# EAGLE design PIC PROTO-BOARD-SMD (EAGLE 9.2.2)

## Sheet 1 of 3
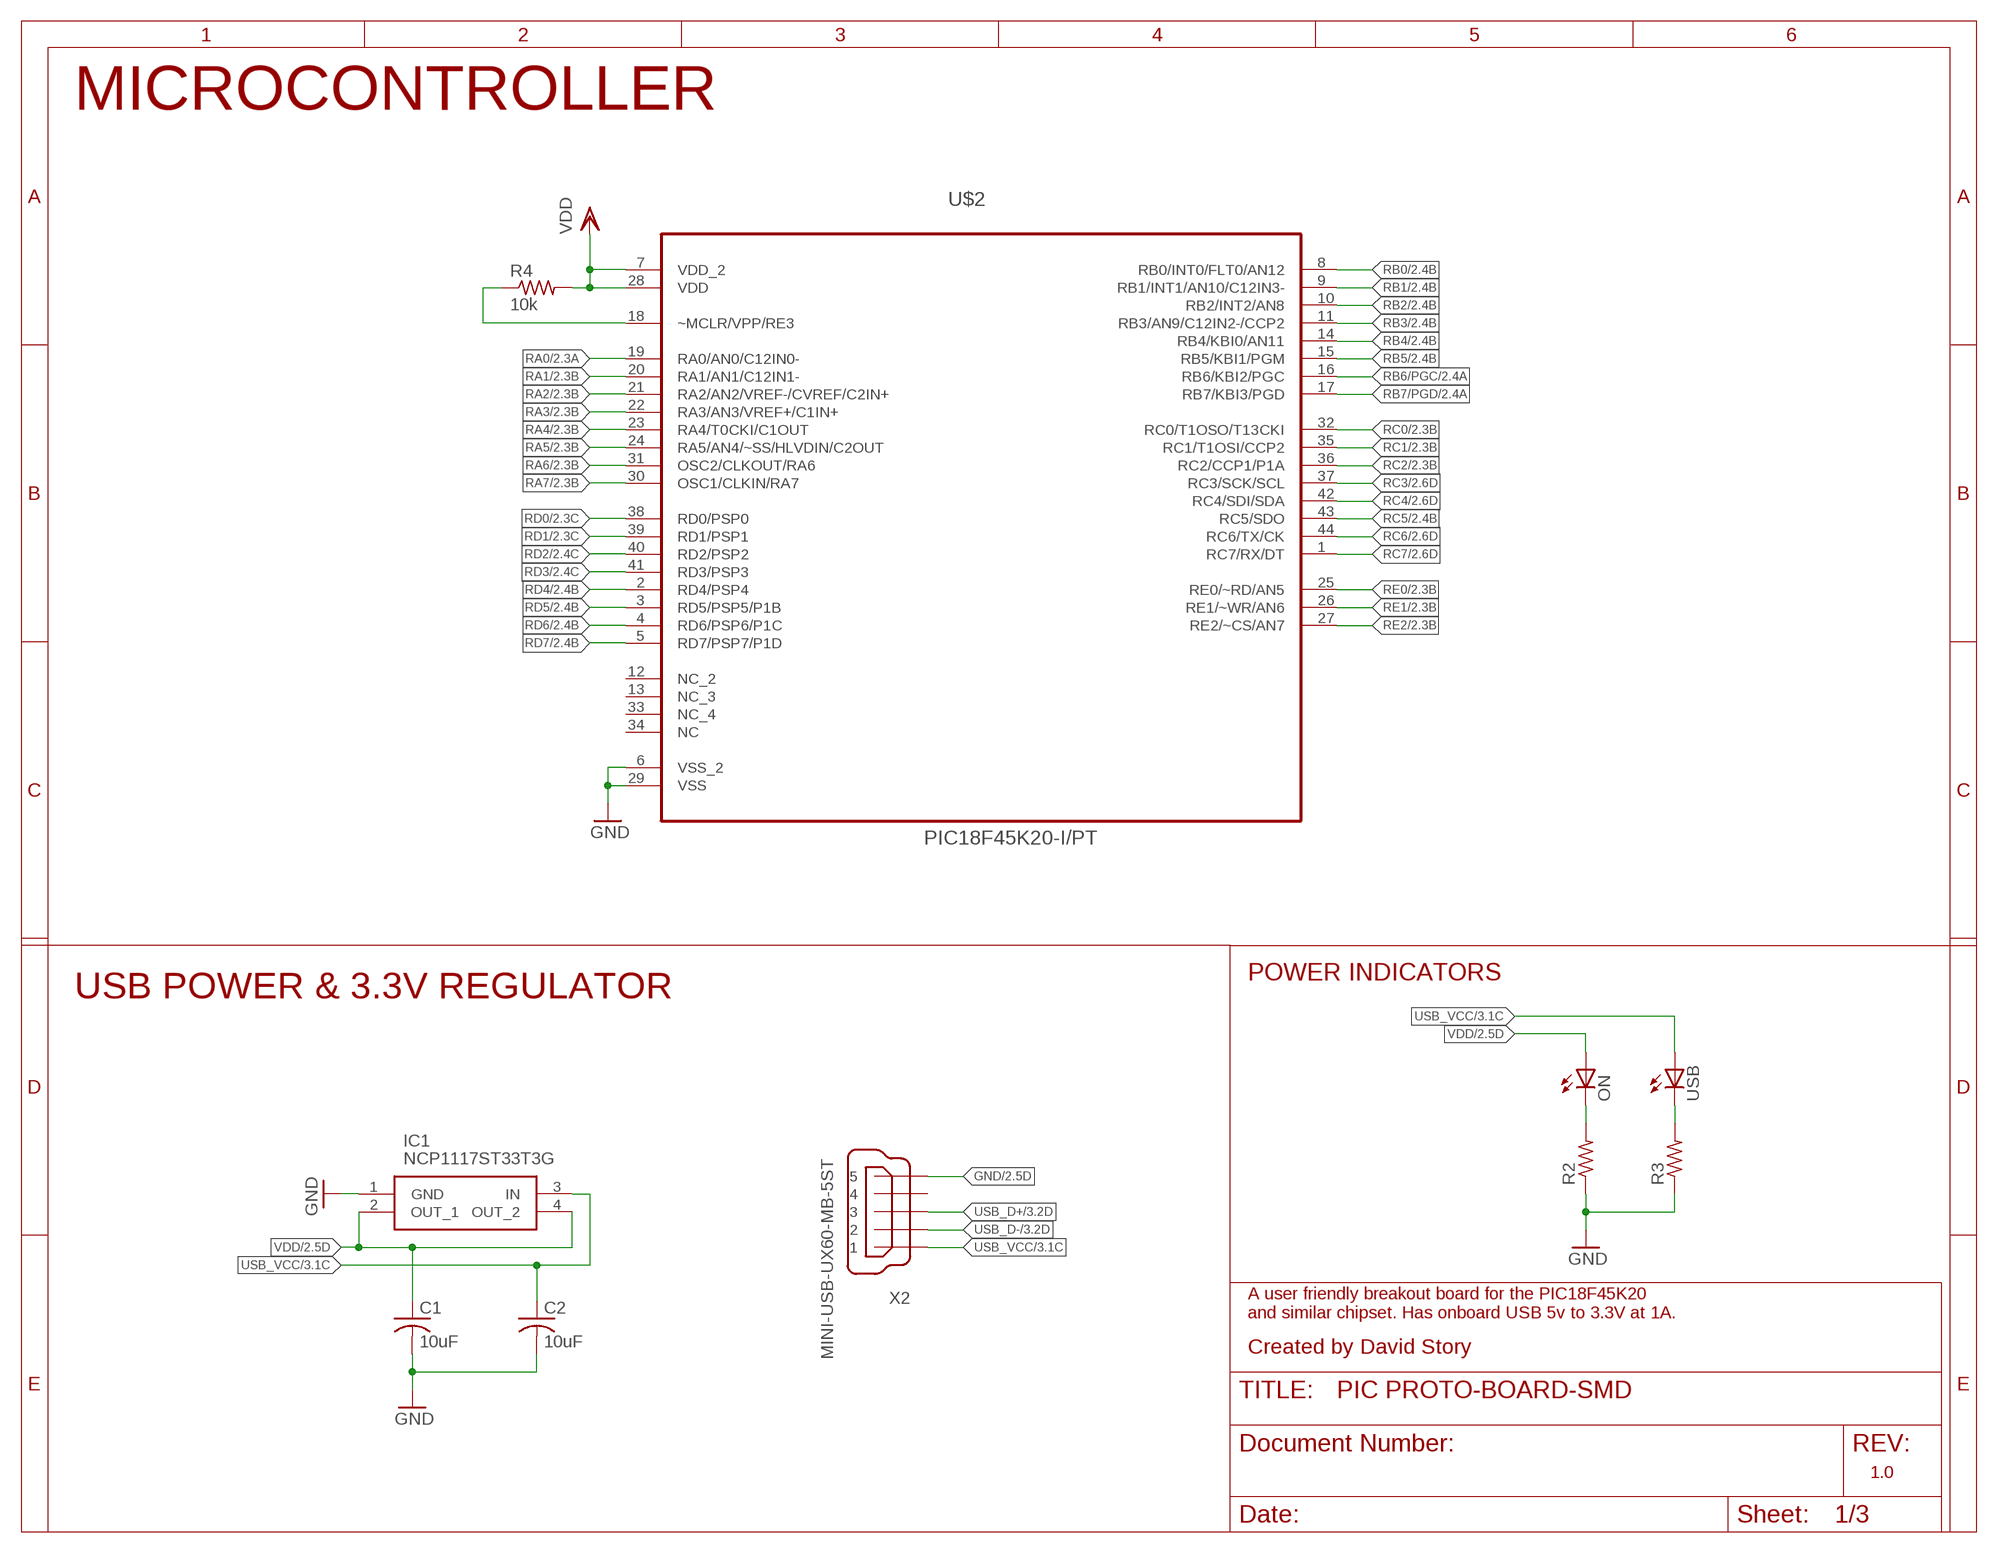
[diagram p0: schematic, sheet 1]

### Parts
C1  10uF  C-USC0805  [C0805]
C2  10uF  C-USC0805  [C0805]
IC1  NCP1117ST33T3G  [SOT230P700X180-4N]
ON  LEDCHIP-LED0603  [CHIP-LED0603]
R2  R-US_R0603  [R0603]
R3  R-US_R0603  [R0603]
R4  10k  R-US_R0805  [R0805]
U$2  PIC18F45K20-I/PT  [QFP80P1200X1200X120-44N]
USB  LEDCHIP-LED0603  [CHIP-LED0603]
X2  MINI-USB-UX60-MB-5ST  [UX60-MB-5ST]

### Nets
GND: C1.2 C2.2 IC1.1(GND) R2.1 R3.1 U$2.6(VSS_2) U$2.29(VSS) X2.5 ; also sheet 2,3
MCLR: R4.1 U$2.18(~MCLR/VPP/RE3) ; also sheet 2
ON_CATHODE: ON.C R2.2
RA0: U$2.19(RA0/AN0/C12IN0-) ; also sheet 2
RA1: U$2.20(RA1/AN1/C12IN1-) ; also sheet 2
RA2: U$2.21(RA2/AN2/VREF-/CVREF/C2IN+) ; also sheet 2
RA3: U$2.22(RA3/AN3/VREF+/C1IN+) ; also sheet 2
RA4: U$2.23(RA4/T0CKI/C1OUT) ; also sheet 2
RA5: U$2.24(RA5/AN4/~SS/HLVDIN/C2OUT) ; also sheet 2
RA6: U$2.31(OSC2/CLKOUT/RA6) ; also sheet 2
RA7: U$2.30(OSC1/CLKIN/RA7) ; also sheet 2
RB0: U$2.8(RB0/INT0/FLT0/AN12) ; also sheet 2
RB1: U$2.9(RB1/INT1/AN10/C12IN3-) ; also sheet 2
RB2: U$2.10(RB2/INT2/AN8) ; also sheet 2
RB3: U$2.11(RB3/AN9/C12IN2-/CCP2) ; also sheet 2
RB4: U$2.14(RB4/KBI0/AN11) ; also sheet 2
RB5: U$2.15(RB5/KBI1/PGM) ; also sheet 2
RB6/PGC: U$2.16(RB6/KBI2/PGC) ; also sheet 2
RB7/PGD: U$2.17(RB7/KBI3/PGD) ; also sheet 2
RC0: U$2.32(RC0/T1OSO/T13CKI) ; also sheet 2
RC1: U$2.35(RC1/T1OSI/CCP2) ; also sheet 2
RC2: U$2.36(RC2/CCP1/P1A) ; also sheet 2
RC3: U$2.37(RC3/SCK/SCL) ; also sheet 2,3
RC4: U$2.42(RC4/SDI/SDA) ; also sheet 2,3
RC5: U$2.43(RC5/SDO) ; also sheet 2
RC6: U$2.44(RC6/TX/CK) ; also sheet 2,3
RC7: U$2.1(RC7/RX/DT) ; also sheet 2,3
RD0: U$2.38(RD0/PSP0) ; also sheet 2
RD1: U$2.39(RD1/PSP1) ; also sheet 2
RD2: U$2.40(RD2/PSP2) ; also sheet 2
RD3: U$2.41(RD3/PSP3) ; also sheet 2
RD4: U$2.2(RD4/PSP4) ; also sheet 2
RD5: U$2.3(RD5/PSP5/P1B) ; also sheet 2
RD6: U$2.4(RD6/PSP6/P1C) ; also sheet 2
RD7: U$2.5(RD7/PSP7/P1D) ; also sheet 2
RE0: U$2.25(RE0/~RD/AN5) ; also sheet 2,3
RE1: U$2.26(RE1/~WR/AN6) ; also sheet 2,3
RE2: U$2.27(RE2/~CS/AN7) ; also sheet 2
USB_CATHODE: R3.2 USB.C
USB_D+: X2.3 ; also sheet 3
USB_D-: X2.2 ; also sheet 3
USB_VCC: C2.1 IC1.3(IN) USB.A X2.1 ; also sheet 3
VDD: C1.1 IC1.2(OUT_1) IC1.4(OUT_2) ON.A R4.2 U$2.7(VDD_2) U$2.28(VDD) ; also sheet 2,3
Unconnected: U$2.12(NC_2) U$2.13(NC_3) U$2.33(NC_4) U$2.34(NC) X2.4

### Notes on the sheet
- MICROCONTROLLER
- POWER INDICATORS
- USB POWER & 3.3V REGULATOR
- A user friendly breakout board for the PIC18F45K20
  and similar chipset. Has onboard USB 5v to 3.3V at 1A.
- Created by David Story
- 1.0

## Sheet 2 of 3
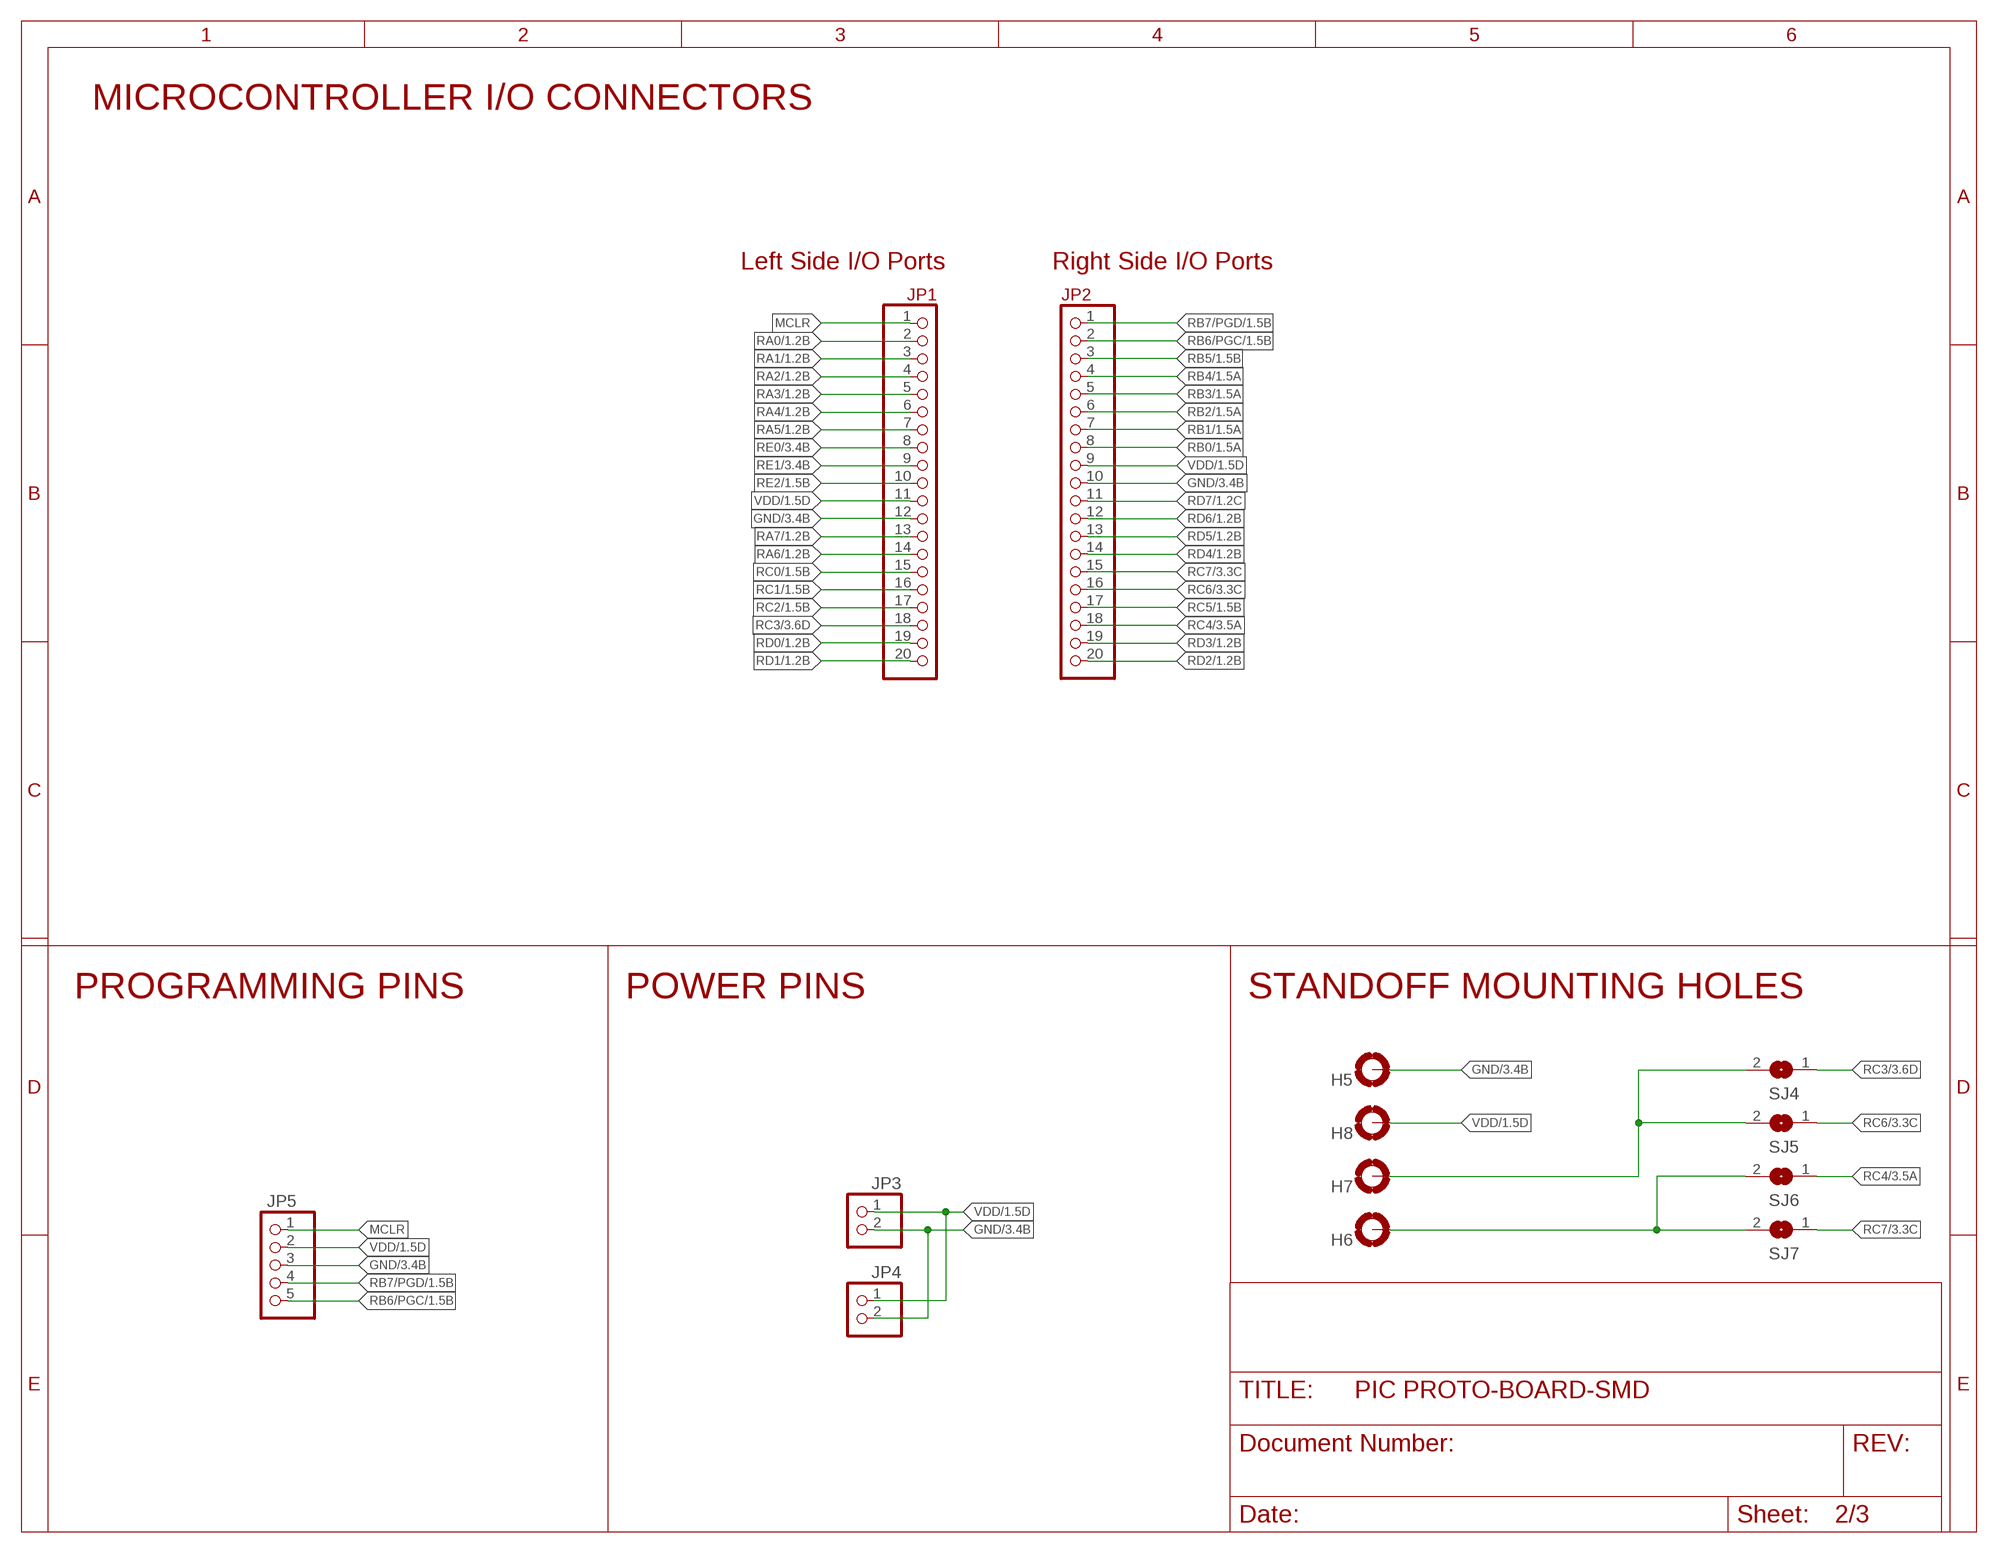
[diagram p1: schematic, sheet 2]

### Parts
H5  MOUNT-PAD-ROUND3.3  [3,3-PAD]
H6  MOUNT-PAD-ROUND3.3  [3,3-PAD]
H7  MOUNT-PAD-ROUND3.3  [3,3-PAD]
H8  MOUNT-PAD-ROUND3.3  [3,3-PAD]
JP1  PINHD-1X20  [1X20]
JP2  PINHD-1X20  [1X20]
JP3  PINHD-1X2  [1X02]
JP4  PINHD-1X2  [1X02]
JP5  PINHD-1X5  [1X05]
SJ4  SJ  [SJ]
SJ5  SJ  [SJ]
SJ6  SJ  [SJ]
SJ7  SJ  [SJ]

### Nets
COM_HOLE_1: H7.B3,3(MOUNT) SJ4.2 SJ5.2
COM_HOLE_2: H6.B3,3(MOUNT) SJ6.2 SJ7.2
GND: H5.B3,3(MOUNT) JP1.12 JP2.10 JP3.2 JP4.2 JP5.3 ; also sheet 1,3
MCLR: JP1.1 JP5.1 ; also sheet 1
RA0: JP1.2 ; also sheet 1
RA1: JP1.3 ; also sheet 1
RA2: JP1.4 ; also sheet 1
RA3: JP1.5 ; also sheet 1
RA4: JP1.6 ; also sheet 1
RA5: JP1.7 ; also sheet 1
RA6: JP1.14 ; also sheet 1
RA7: JP1.13 ; also sheet 1
RB0: JP2.8 ; also sheet 1
RB1: JP2.7 ; also sheet 1
RB2: JP2.6 ; also sheet 1
RB3: JP2.5 ; also sheet 1
RB4: JP2.4 ; also sheet 1
RB5: JP2.3 ; also sheet 1
RB6/PGC: JP2.2 JP5.5 ; also sheet 1
RB7/PGD: JP2.1 JP5.4 ; also sheet 1
RC0: JP1.15 ; also sheet 1
RC1: JP1.16 ; also sheet 1
RC2: JP1.17 ; also sheet 1
RC3: JP1.18 SJ4.1 ; also sheet 1,3
RC4: JP2.18 SJ6.1 ; also sheet 1,3
RC5: JP2.17 ; also sheet 1
RC6: JP2.16 SJ5.1 ; also sheet 1,3
RC7: JP2.15 SJ7.1 ; also sheet 1,3
RD0: JP1.19 ; also sheet 1
RD1: JP1.20 ; also sheet 1
RD2: JP2.20 ; also sheet 1
RD3: JP2.19 ; also sheet 1
RD4: JP2.14 ; also sheet 1
RD5: JP2.13 ; also sheet 1
RD6: JP2.12 ; also sheet 1
RD7: JP2.11 ; also sheet 1
RE0: JP1.8 ; also sheet 1,3
RE1: JP1.9 ; also sheet 1,3
RE2: JP1.10 ; also sheet 1
VDD: H8.B3,3(MOUNT) JP1.11 JP2.9 JP3.1 JP4.1 JP5.2 ; also sheet 1,3

### Notes on the sheet
- MICROCONTROLLER I/O CONNECTORS
- Left Side I/O Ports | Right Side I/O Ports
- PROGRAMMING PINS | POWER PINS | STANDOFF MOUNTING HOLES

## Sheet 3 of 3
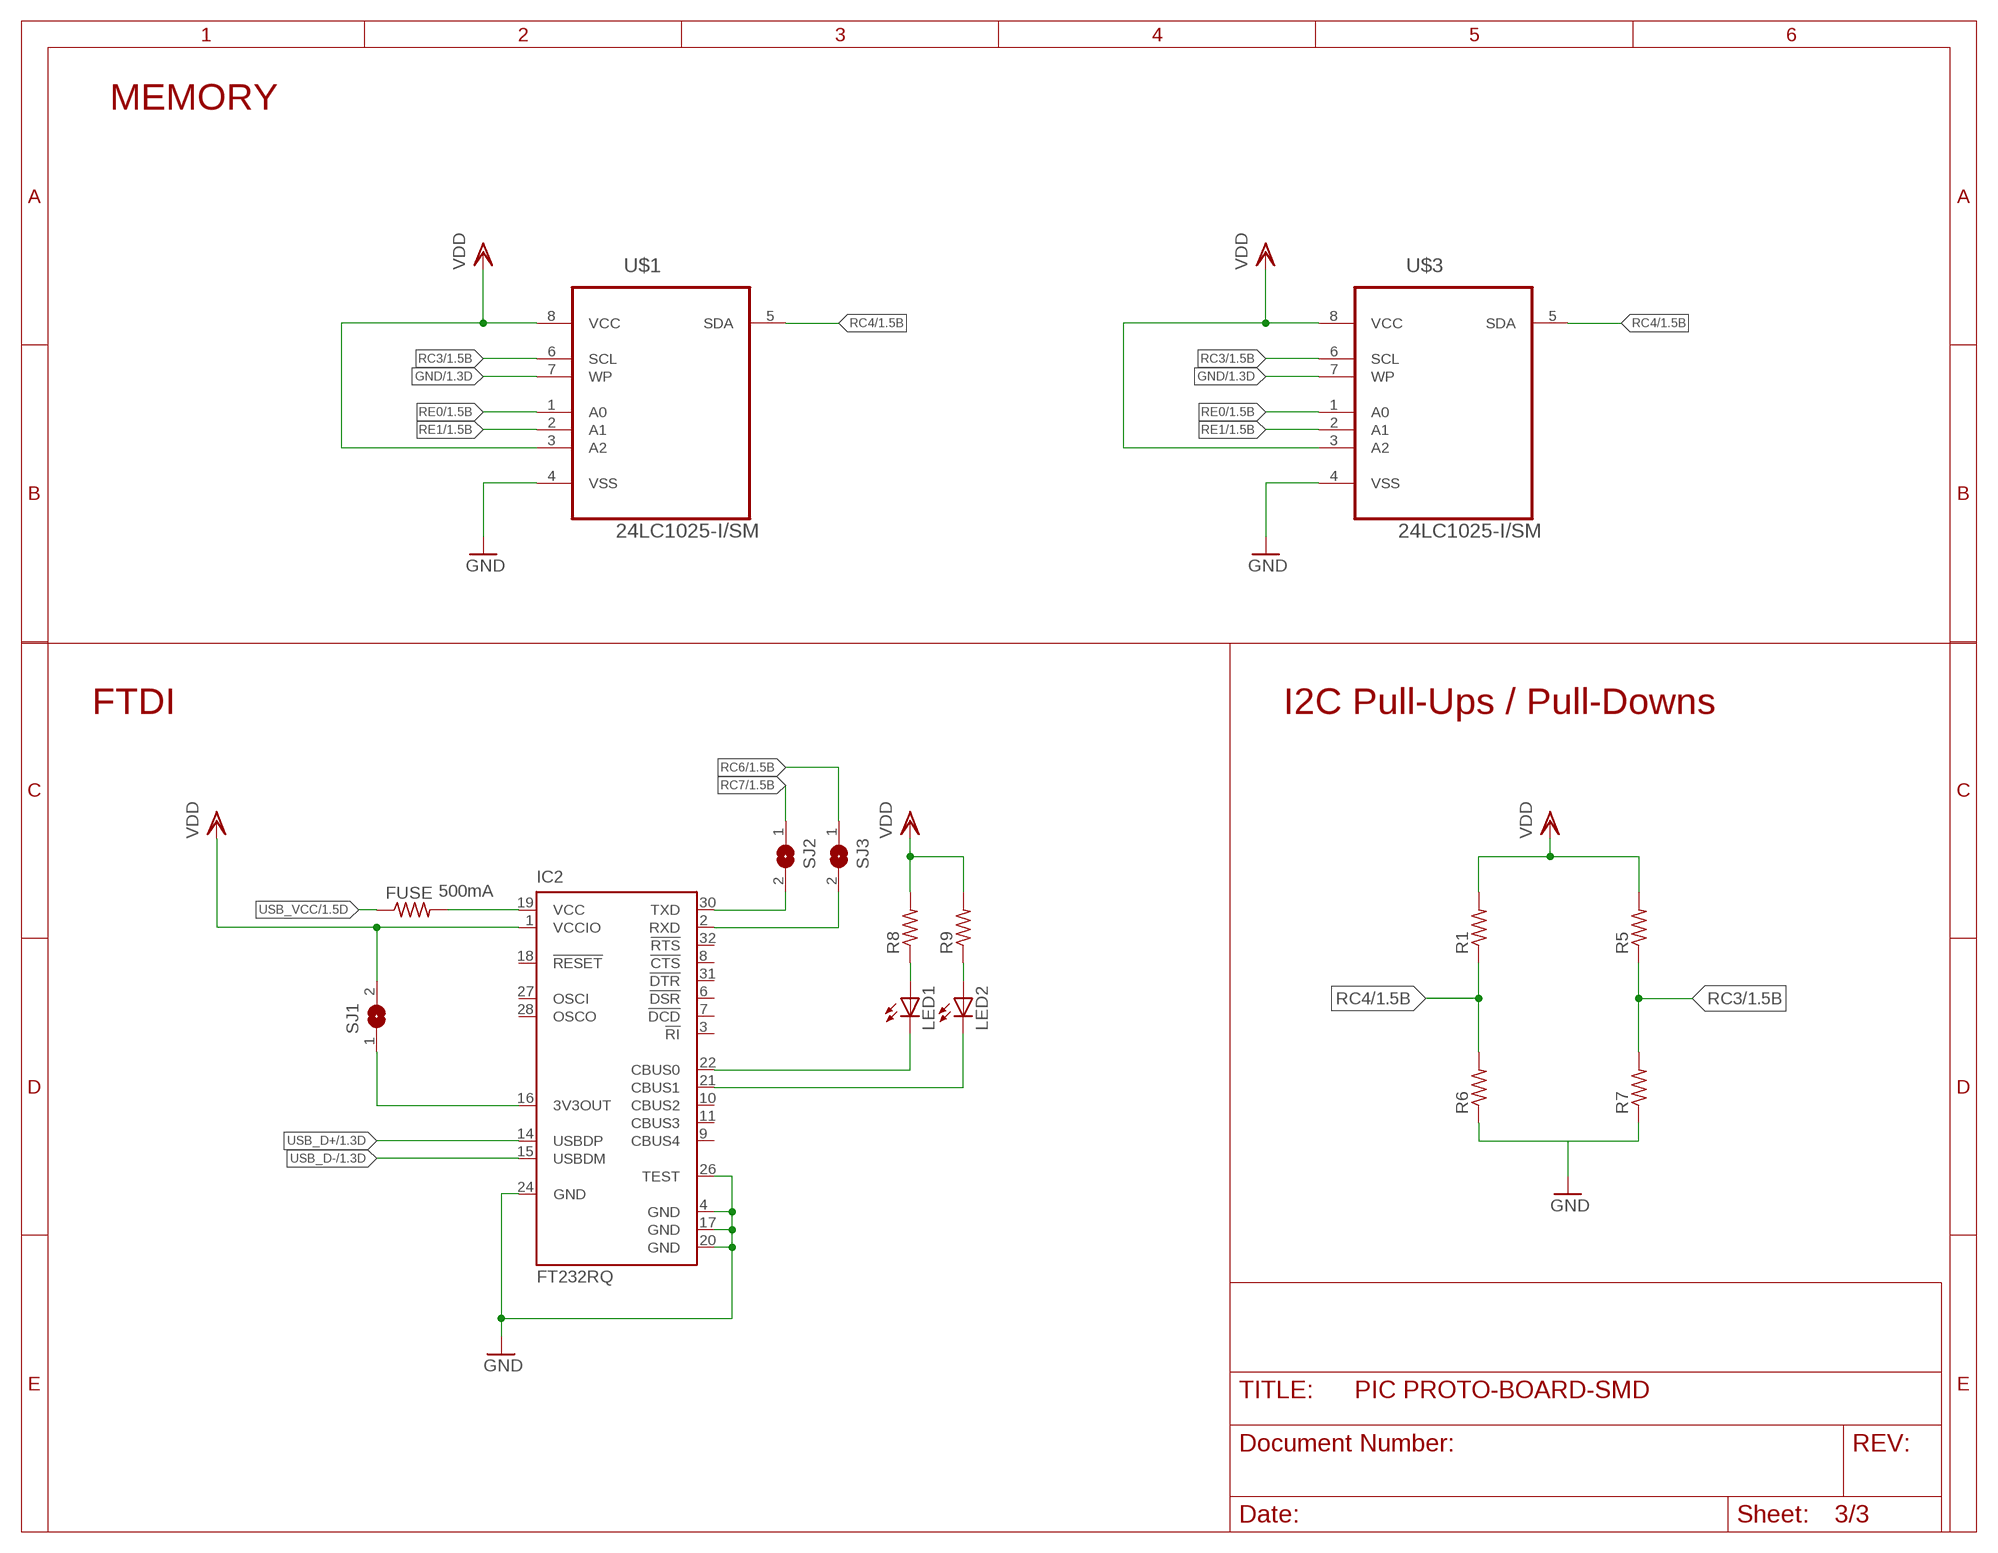
[diagram p2: schematic, sheet 3]

### Parts
FUSE  500mA  R-US_M0805  [M0805]
IC2  FT232RQ  [QFN32]
LED1  LEDSML0603  [SML0603]
LED2  LEDSML0603  [SML0603]
R1  R-US_R0805  [R0805]
R5  R-US_R0805  [R0805]
R6  R-US_R0805  [R0805]
R7  R-US_R0805  [R0805]
R8  R-US_R0805  [R0805]
R9  R-US_R0805  [R0805]
SJ1  SJ  [SJ]
SJ2  SJ  [SJ]
SJ3  SJ  [SJ]
U$1  24LC1025-I/SM  [SOIC127P794X203-8N]
U$3  24LC1025-I/SM  [SOIC127P794X203-8N]

### Nets
3V3OUT: IC2.16(3V3OUT) SJ1.1
FUSE_TO_FTDI: FUSE.2 IC2.19(VCC)
GND: IC2.4(GND) IC2.17(GND) IC2.20(GND) IC2.24(GND) IC2.26(TEST) R6.1 R7.1 U$1.4(VSS) U$1.7(WP) U$3.4(VSS) U$3.7(WP) ; also sheet 1,2
LEDTX: LED1.A R8.1
RC3: R5.1 R7.2 U$1.6(SCL) U$3.6(SCL) ; also sheet 1,2
RC4: R1.1 R6.2 U$1.5(SDA) U$3.5(SDA) ; also sheet 1,2
RC6: SJ3.1 ; also sheet 1,2
RC7: SJ2.1 ; also sheet 1,2
RE0: U$1.1(A0) U$3.1(A0) ; also sheet 1,2
RE1: U$1.2(A1) U$3.2(A1) ; also sheet 1,2
RX_LED: IC2.21(CBUS1) LED2.C
RXD: IC2.2(RXD) SJ3.2
RXLED: LED2.A R9.1
TX_LED: IC2.22(CBUS0) LED1.C
TXD: IC2.30(TXD) SJ2.2
USB_D+: IC2.14(USBDP) ; also sheet 1
USB_D-: IC2.15(USBDM) ; also sheet 1
USB_VCC: FUSE.1 ; also sheet 1
VDD: IC2.1(VCCIO) R1.2 R5.2 R8.2 R9.2 SJ1.2 U$1.3(A2) U$1.8(VCC) U$3.3(A2) U$3.8(VCC) ; also sheet 1,2
Unconnected: IC2.3(!RI) IC2.6(!DSR) IC2.7(!DCD) IC2.8(!CTS) IC2.9(CBUS4) IC2.10(CBUS2) IC2.11(CBUS3) IC2.18(!RESET) IC2.27(OSCI) IC2.28(OSCO) IC2.31(!DTR) IC2.32(!RTS)

### Notes on the sheet
- MEMORY
- FTDI | I2C Pull-Ups / Pull-Downs

## Library data of the parts
C1 C2 = rcl:C-US: CAPACITOR, American symbol; SPICEPREFIX: C
FUSE R1-R9 = rcl:R-US_: RESISTOR, American symbol; SPICEPREFIX: R
H5-H8 = holes:MOUNT-PAD-ROUND: MOUNTING PAD, round
IC1 = SamacSys_Parts:NCP1117ST33T3G: ON SEMICONDUCTOR - NCP1117ST33T3G - IC, LINEAR VOLTAGE REGULATOR Source: Datasheet <https://componentsearchengine.com/Datasheets/1/NCP1117ST33T3G.pdf>; DESCRIPTION: ON SEMICONDUCTOR - NCP1117ST33T3G - IC, LINEAR VOLTAGE REGULATOR; HEIGHT: 1.8mm; MANUFACTURER_NAME: ON Semiconductor; MANUFACTURER_PART_NUMBER: NCP1117ST33T3G; MOUSER_PART_NUMBER: 863-NCP1117ST33T3G
IC2 = ftdichip:FT232R: Source: http://www.ftdichip.com/Documents/DataSheets/DS_FT232R_v104.pdf; MPN: FT232RQ; OC_FARNELL: 1146033; OC_NEWARK: 91K9919
JP1 JP2 = pinhead:PINHD-1X20: PIN HEADER
JP3 JP4 = pinhead:PINHD-1X2: PIN HEADER
JP5 = pinhead:PINHD-1X5: PIN HEADER
LED1 LED2 ON USB = led:LED: LED OSRAM: - CHIPLED LG R971, LG N971, LY N971, LG Q971, LY Q971, LO R971, LY R971 LH N974, LH R974 LS Q976, LO Q976, LY Q976 LO Q996 - Hyper CHIPLED LW Q18S LB Q993, LB Q99A, LB R99A - SideLED LS A670, LO A670, LY A670, LG A670, LP A670 LB A673, LV A673, LT A673, LW A673 LH A674 LY A675 LS A676, LA A676, LO A676, LY A676, LW A676 LS A679, LY A679, LG A679 - Hyper Micro SIDELED® LS Y876, LA Y876, LO Y876, LY Y876 LT Y87S - SmartLED LW L88C, LW L88S LB L89C, LB L89S, LG L890 LS L89K, LO L89K, LY L89K LS L896, LA L896, LO L896, LY L896 - TOPLED LS T670, LO T670, LY T670, LG T670, LP T670 LSG T670, LSP T670, LSY T670, LOP T670, LYG T670 LG T671, LOG T671, LSG T671 LB T673, LV T673, LT T673, LW T673 LH T674 LS T676, LA T676, LO T676, LY T676, LB T676, LH T676, LSB T676, LW T676 LB T67C, LV T67C, LT T67C, LS T67K, LO T67K, LY T67K, LW E67C LS E67B, LA E67B, LO E67B, LY E67B, LB E67C, LV E67C, LT E67C LW T67C LS T679, LY T679, LG T679 LS T770, LO T770, LY T770, LG T770, LP T770 LB T773, LV T773, LT T773, LW T773 LH T774 LS E675, LA E675, LY E675, LS T675 LS T776, LA T776, LO T776, LY T776, LB T776 LHGB T686 LT T68C, LB T68C - Hyper Mini TOPLED® LB M676 - Mini TOPLED Santana® LG M470 LS M47K, LO M47K, LY M47K Source: http://www.osram.convergy.de LUXEON: - LUMILED® LXK2-PW12-R00, LXK2-PW12-S00, LXK2-PW14-U00, LXK2-PW14-V00 LXK2-PM12-R00, LXK2-PM12-S00, LXK2-PM14-U00 LXK2-PE12-Q00, LXK2-PE12-R00, LXK2-PE12-S00, LXK2-PE14-T00, LXK2-PE14-U00 LXK2-PB12-K00, LXK2-PB12-L00, LXK2-PB12-M00, LXK2-PB14-N00, LXK2-PB14-P00, LXK2-PB14-Q00 LXK2-PR12-L00, LXK2-PR12-M00, LXK2-PR14-Q00, LXK2-PR14-R00 LXK2-PD12-Q00, LXK2-PD12-R00, LXK2-PD12-S00 LXK2-PH12-R00, LXK2-PH12-S00 LXK2-PL12-P00, LXK2-PL12-Q00, LXK2-PL12-R00 Source: www.luxeon.com KINGBRIGHT: KA-3528ASYC Source: www.kingbright.com
SJ1-SJ7 = jumper:SJ: SMD solder JUMPER
U$1 U$3 = Microchip_By_element14_Batch_1:24LC1025-I/SM: 1024K I2C CMOS Serial EEPROM; MPN: 24LC1025-I/SM; OC_FARNELL: 1331323; OC_NEWARK: 31K5811; PACKAGE: SOIC-8; SUPPLIER: MICROCHIP
U$2 = Microchip_By_element14_Batch_1:PIC18F45K20-I/PT: Flash Microcontrollers; MPN: PIC18F45K20-I/PT; OC_FARNELL: 1439589; OC_NEWARK: 88K6042; PACKAGE: QFP-44; SUPPLIER: Microchip
X2 = con-hirose:MINI-USB-: MINI USB Connector Source: http://www.hirose.co.jp/cataloge_hp/e24000019.pdf; OC_FARNELL: unknown; OC_NEWARK: unknown

## Board
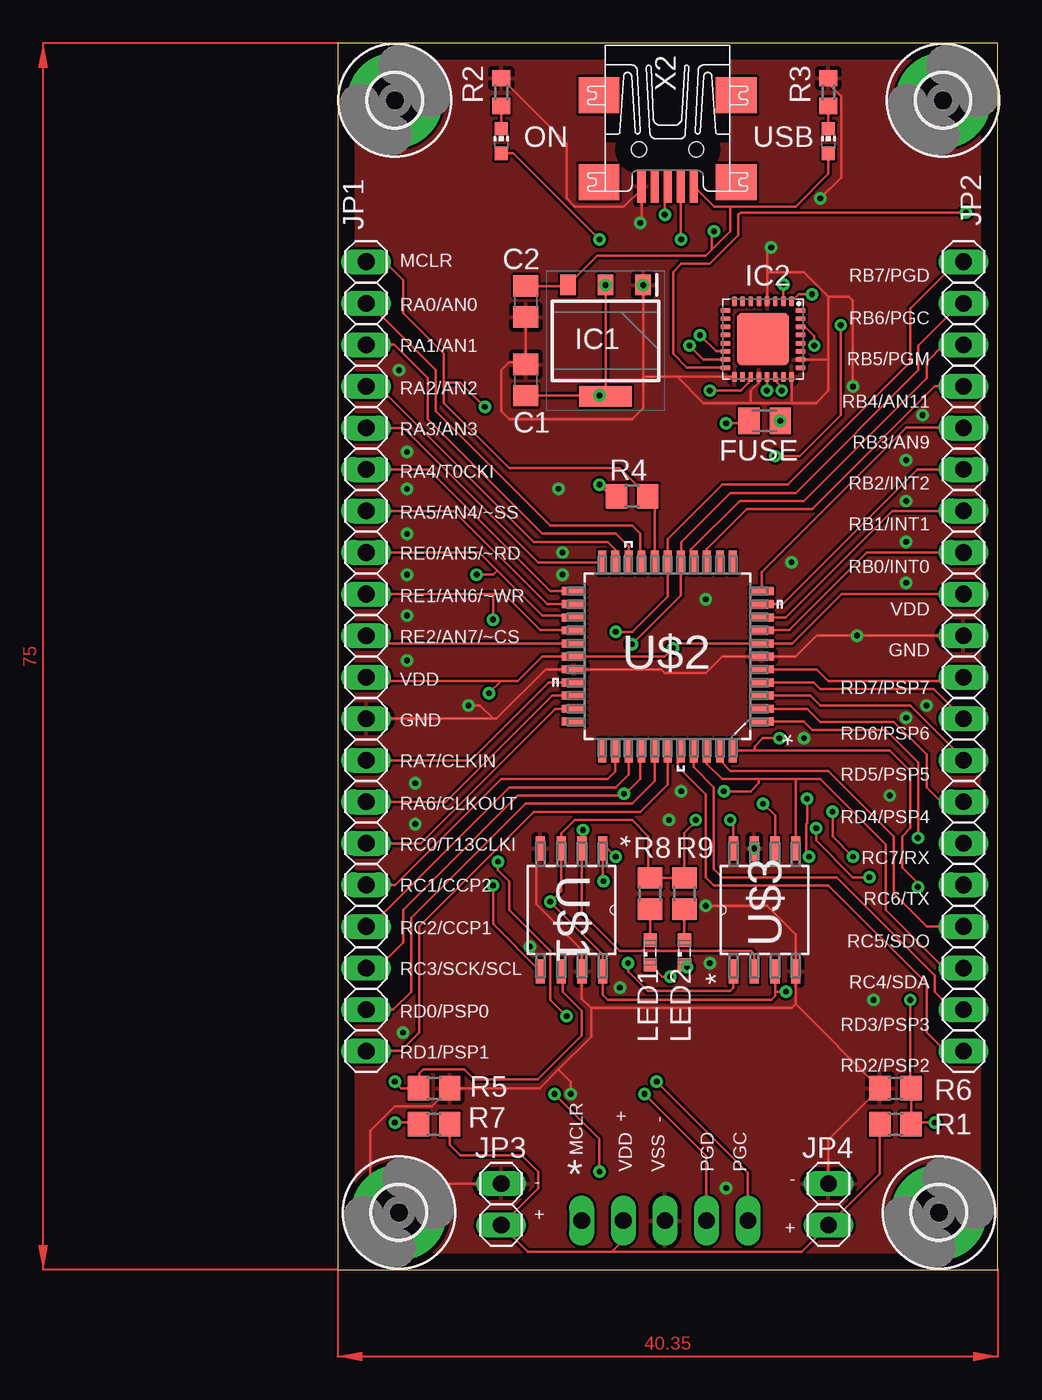
[diagram p3: board, top side]
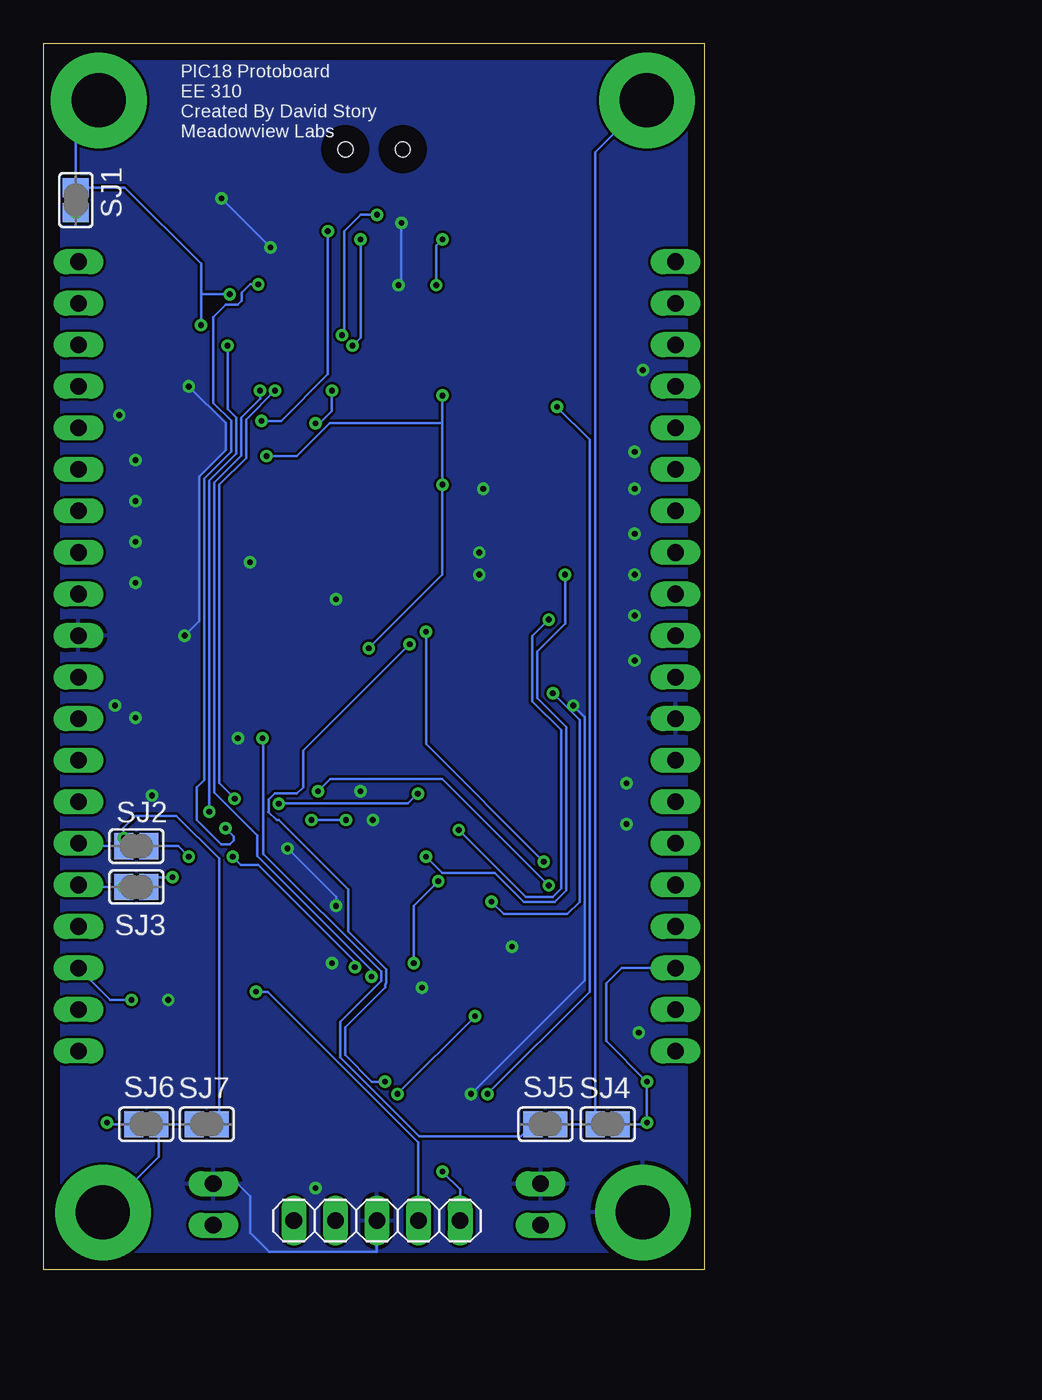
[diagram p4: board, bottom side, seen from below]

Size 40.35 x 75 mm. Coordinates in mm from the lower left corner, seen from the top.
Outline: 0,0 40.35,0 40.35,75 0,75 0,0
Copper layers (1*16): Top 0.035mm / dielectric 1.5mm / Bottom 0.035mm
Design rules "default": minimum track width 6mil, minimum drill 0.35mm, track to track 6mil, track to pad 6mil, pad to pad 6mil, via to via 6mil, smd to smd 6mil, copper to edge 40mil, drill to drill 6mil, minimum pad ring 10mil, minimum via ring 8mil, stop-mask expansion 4mil, vias tented up to drill 0mil, thermal gap 10mil

### Footprints (pad centres in the part's own frame; a part is rotated, then mirrored left to right if it is on the bottom)
C0805 = smd 1.3 x 1.5: 1 -0.95,0; 2 0.95,0
M0805 = smd 1.3 x 1.6: 1 -0.95,0; 2 0.95,0
3,3-PAD = drill 3.3 pad 5.842: B3,3 0,0
SOT230P700X180-4N = smd 1.25 x 0.95: 1 -3.4,2.3; 2 -3.4,0; 3 -3.4,-2.3 | smd 1.25 x 3.2: 4 3.4,0
QFN32 = smd 0.6 x 0.3: 1 -2.3,1.75; 2 -2.3,1.25; 3 -2.3,0.75; 4 -2.3,0.25; 5 -2.3,-0.25; 6 -2.3,-0.75; 7 -2.3,-1.25; 8 -2.3,-1.75; 17 2.3,-1.75; 18 2.3,-1.25; 19 2.3,-0.75; 20 2.3,-0.25; 21 2.3,0.25; 22 2.3,0.75; 23 2.3,1.25; 24 2.3,1.75 | smd 0.3 x 0.6: 9 -1.75,-2.3; 10 -1.25,-2.3; 11 -0.75,-2.3; 12 -0.25,-2.3; 13 0.25,-2.3; 14 0.75,-2.3; 15 1.25,-2.3; 16 1.75,-2.3; 25 1.75,2.3; 26 1.25,2.3; 27 0.75,2.3; 28 0.25,2.3; 29 -0.25,2.3; 30 -0.75,2.3; 31 -1.25,2.3; 32 -1.75,2.3 | smd 3.2 x 3.2: EXP 0,0
1X20 = drill 1.016 long: 1 -24.13,0; 2 -21.59,0; 3 -19.05,0; 4 -16.51,0; 5 -13.97,0; 6 -11.43,0; 7 -8.89,0; 8 -6.35,0; 9 -3.81,0; 10 -1.27,0; 11 1.27,0; 12 3.81,0; 13 6.35,0; 14 8.89,0; 15 11.43,0; 16 13.97,0; 17 16.51,0; 18 19.05,0; 19 21.59,0; 20 24.13,0
1X02 = drill 1.016 long: 1 -1.27,0; 2 1.27,0
1X05 = drill 1.016 long: 1 -5.08,0; 2 -2.54,0; 3 0,0; 4 2.54,0; 5 5.08,0
SML0603 = smd 0.8 x 0.8: A 0.75,0; C -0.75,0
CHIP-LED0603 = smd 0.8 x 0.8: A 0,-0.75; C 0,0.75
R0805 = smd 1.3 x 1.5: 1 -0.95,0; 2 0.95,0
R0603 = smd 1 x 1.1: 1 -0.85,0; 2 0.85,0
SJ = smd 1.168 x 1.6: 1 -0.762,0; 2 0.762,0
SOIC127P794X203-8N = smd 1.473 x 0.559: 1 -3.759,1.905; 2 -3.759,0.635; 3 -3.759,-0.635; 4 -3.759,-1.905; 5 3.759,-1.905; 6 3.759,-0.635; 7 3.759,0.635; 8 3.759,1.905
QFP80P1200X1200X120-44N = smd 1.473 x 0.483: 1 -5.74,3.988; 2 -5.74,3.2; 3 -5.74,2.388; 4 -5.74,1.6; 5 -5.74,0.787; 6 -5.74,0; 7 -5.74,-0.787; 8 -5.74,-1.6; 9 -5.74,-2.388; 10 -5.74,-3.2; 11 -5.74,-3.988; 23 5.74,-3.988; 24 5.74,-3.2; 25 5.74,-2.388; 26 5.74,-1.6; 27 5.74,-0.787; 28 5.74,0; 29 5.74,0.787; 30 5.74,1.6; 31 5.74,2.388; 32 5.74,3.2; 33 5.74,3.988 | smd 0.483 x 1.473: 12 -3.988,-5.74; 13 -3.2,-5.74; 14 -2.388,-5.74; 15 -1.6,-5.74; 16 -0.787,-5.74; 17 0,-5.74; 18 0.787,-5.74; 19 1.6,-5.74; 20 2.388,-5.74; 21 3.2,-5.74; 22 3.988,-5.74; 34 3.988,5.74; 35 3.2,5.74; 36 2.388,5.74; 37 1.6,5.74; 38 0.787,5.74; 39 0,5.74; 40 -0.787,5.74; 41 -1.6,5.74; 42 -2.388,5.74; 43 -3.2,5.74; 44 -3.988,5.74
UX60-MB-5ST = smd 2 x 0.5: 1 2.25,1.6; 2 2.25,0.8; 3 2.25,0; 4 2.25,-0.8; 5 2.25,-1.6 | smd 2.2 x 2.5: M1 -3.3,-4.2; M2 -3.3,4.2; M3 2,4.2; M4 2,-4.2 | hole 0.9: 0,-1.75; 0,1.75

### Placement (x,y rotation side)
C1  11.5,54.4 90 top
C2  11.5,59.2 270 top
FUSE  26.1,51.9 180 top
H5  3.75,3.5 0 top
H6  36.75,3.5 0 top
H7  3.5,71.5 0 top
H8  37,71.5 0 top
IC1  16.38,56.8 270 top
IC2  26,56.9 270 top
JP1  1.75,37.5 270 top
JP2  38.25,37.5 270 top
JP3  10,4 90 top
JP4  30,4 90 top
JP5  20,3 180 bottom
LED1  19.1,19.4 90 top
LED2  21.2,19.4 90 top
ON  10,69 0 top
R1  34.1,8.9 180 top
R2  10,72 270 top
R3  30,72 270 top
R4  18,47.3 180 top
R5  5.9,8.9 0 top
R6  34.1,11.1 0 top
R7  5.9,11.1 180 top
R8  19.1,23 90 top
R9  21.2,23 90 top
SJ1  38.4,65.4 90 bottom
SJ2  34.7,25.9 0 bottom
SJ3  34.7,23.4 0 bottom
SJ4  5.9,8.9 180 bottom
SJ5  9.7,8.9 0 bottom
SJ6  34.1,8.9 0 bottom
SJ7  30.4,8.9 180 bottom
U$1  14.3,22 270 top
U$2  20.18,37.5 180 top
U$3  26.1,22 90 top
USB  30,69 0 top
X2  20.18,68.5 270 top

### Tracks (layer width: path | path; a pad name or v marks a point on that pad's centre or on a via)
3V3OUT  (via drill 0.35)
  Top 0.152: IC2.16 21.35,55.15 20.5,56 20.5,61 21,61.5 22.75,61.5 24.5,63.25 24.5,64.5 24.64,64.64 SJ1.1
  other vias: 38.4,64.64
COM_HOLE_1
  Bottom 0.152: SJ5.2 SJ4.2 6.66,68.34 H7.B3,3
COM_HOLE_2
  Bottom 0.152: H6.B3,3 33.34,6.91 SJ6.2 SJ7.2
FUSE_TO_FTDI  (via drill 0.35)
  Top 0.152: IC2.19 25.13,54.48 25.13,54.23 24.65,53.75 v22.75,53.75 | v23.75,51.75 25,51.75 FUSE.2
  Bottom 0.152: v22.75,53.75 22.75,52.5 23.5,51.75 v23.75,51.75
GND  (via drill 0.35)
  Top 0.152: 9.5,33.69 9.69,33.69 12.71,36.71 U$2.29 19.79,36.71 20,36.5 22.5,36.5 23.5,37.5 U$2.6 28,37.5 29.27,38.77 v31.75,38.77 JP2.10 | 9.5,33.69 JP1.12 | C2.2 11.5,55.5 | 11.5,55.5 C1.2 | IC1.1 18.68,54.5 | 18.68,54.5 18.68,52.67 18,52 10.5,52 10,52.5 10,55 10.5,55.5 11.5,55.5 | IC2.17 20.75,54.6 | 20.75,54.6 18.77,54.6 18.68,54.5 | R2.1 14,68.85 14,65.5 14.5,65 17.5,65 18.57,66.08 X2.5 18.57,64.08 v18.5,64 | JP4.2 30,7.95 R6.1 28,16.25 | JP3.2 5.52,5.27 H5.B3,3 2,5.25 2,8.5 3.5,10 5.75,10 R7.1 12.35,11.1 13.5,12.25 | 28,16.25 U$3.4 28,20.5 26.25,22.25 v22.5,22.25 | 15.5,16 14.94,16.57 U$1.7 14.94,19.57 12.14,22.36 12.14,25.51 U$1.4 | 15.5,16 27.76,16 28,16.25 | R3.1 30,72.52 30.78,71.75 30.78,66.78 v29.5,65.5 | v26.5,62.5 26.25,62.25 26.25,61 | 26.25,61 IC2.4 | 20.75,54.6 22.35,53 25.25,53 | 25.25,53 27.75,53 | 27.75,53 29.25,53 30,53.75 30,55.75 | 26.25,61 28.5,61 30,59.5 | 30,55.75 30,59.5 | IC2.26 29.9,55.65 30,55.75 | IC2.24 27.75,53 | IC2.20 25.75,54.25 25.25,53.75 25.25,53 | 30,59.5 31.25,59.5 31.5,59.25 v31.5,54 | 15.5,16 15.5,14.25 13.5,12.25 | 9.5,33.69 8.69,34.5 v8,34.5 | v14.25,10.75 14.25,11.5 13.5,12.25
  Bottom 0.152: v18.5,64 18.5,60.38 IC1.1 | v29.5,65.5 v26.5,62.5 | v31.75,38.77 30.86,39.66 30.86,48.5 29.25,50.11 29.25,51.75 v31.5,54 | JP5.3 20,1.09 26.59,1.09 27.75,2.25 27.75,4.5 28.52,5.27 JP4.2 | U$3.7 22.5,22.79 v22.5,22.25 | v8,34.5 7.3,33.8 7.3,17.7 v14.25,10.75
  other vias: 18.68,60.2 25.46,25.76 4.25,42.5 4.25,40 4.25,37.25 4.25,45 4.25,47.75 4.25,50 3.75,55 13.5,47.75 13.75,42.5 13.75,43.85 22.5,41 27.75,43.25 34.75,44.5 34.75,42 34.75,47 34.75,49.5 35.75,52.25 36,34.5 34.75,33.75 28.5,32.5 33.75,29 21,29.25 20.25,27.5 17.25,17.25 23.75,5 4.75,27.25 4.75,29.75 32.75,16.5 22.75,18.75 4,14.5 11.75,19.75
  pour Bottom: 0,0 0,75 40.25,75 40.25,0
  pour Top: 0,0 0,75 40.25,75 40.25,0
LEDTX
  Top 0.152: LED1.A R8.1
MCLR  (via drill 0.35)
  Top 0.152: U$2.18 19.39,46.86 R4.1 17.25,49 10.5,49 6.5,53 6.5,54.25 | JP1.1 2.87,61.63 4,60.5 4,58.5 6.5,56 6.5,54.25 | v16,6 16,8 v13.25,10.75 | v9,52.75 7.5,54.25 6.5,54.25
  Bottom 0.152: JP5.1 14.92,4.92 v16,6 | v13.25,10.75 7,17 7,50.75 v9,52.75
ON_CATHODE
  Top 0.152: ON.C R2.2
RA0
  Top 0.152: JP1.2 1.91,59.09 6,55 6,52.5 13,45.5 18,45.5 18.5,45 18.5,43.31 U$2.19
RA1
  Top 0.152: JP1.3 3.45,56.55 5.5,54.5 5.5,52 12.5,45 17,45 17.79,44.21 U$2.20
RA2
  Top 0.152: JP1.4 2.49,54.01 12,44.5 16.5,44.5 16.98,44.02 U$2.21
RA3
  Top 0.152: U$2.22 12.26,43.24 4.03,51.47 JP1.5
RA4
  Top 0.152: U$2.23 13.01,41.49 5.57,48.93 JP1.6
RA5
  Top 0.152: U$2.24 12.8,40.7 7.11,46.39 JP1.7
RA6
  Top 0.152: U$2.31 13.11,35.11 6.61,28.61 JP1.14
RA7
  Top 0.152: U$2.30 12.9,35.9 8.15,31.15 JP1.13
RB0
  Top 0.152: U$2.8 27.6,39.1 32.35,43.85 JP2.8
RB1
  Top 0.152: U$2.9 27.39,39.89 33.89,46.39 JP2.7
RB2
  Top 0.152: U$2.10 27.2,40.7 35.43,48.93 JP2.6
RB3
  Top 0.152: U$2.11 25.91,42.66 34.75,51.5 38.22,51.5 JP2.5
RB4
  Top 0.152: U$2.14 22.56,44.06 25,46.5 29,46.5 36.51,54.01 JP2.4
RB5
  Top 0.152: U$2.15 21.59,43.42 21.59,44.02 24.57,47 28.5,47 36,54.5 36,55.5 37.05,56.55 JP2.3
RB6/PGC  (via drill 0.35)
  Top 0.152: JP2.2 38.09,59.09 35.5,56.5 35.5,55 28,47.5 24,47.5 21,44.5 21,43.28 U$2.16 20.96,41.21 v18,38.25 | v19.5,11.5 25.08,5.92 JP5.5
  Bottom 0.152: v18,38.25 24.5,31.75 24.5,29.5 24.89,29.11 26.25,29.11 26.61,28.75 26.61,28.03 26.63,28 26.13,27.5 26,27.5 21.75,23.25 21.75,20.68 19.42,18.36 19.42,17.54 19.5,17.46 19.5,17.25 21.95,14.8 21.95,13.13 20.32,11.5 v19.5,11.5
RB7/PGD  (via drill 0.35)
  Top 0.152: JP2.1 37.88,61.63 35,58.75 35,55.5 27.5,48 23.5,48 20.18,44.67 U$2.17 20.18,41.17 18,39 v17,39 | v9.8,24.95 9.8,24.45 10.5,23.75 10.5,22 13,19.5 13,16.5 v14,15.5 | v18.75,10.75 22.54,6.96 JP5.4
  Bottom 0.152: v17,39 17,32.14 v9.8,24.95 | v14,15.5 v18.75,10.75
RC0
  Top 0.152: U$2.32 13.3,34.3 5.07,26.07 JP1.15
RC1
  Top 0.152: U$2.35 16.98,30.48 16.5,30 10,30 3.53,23.53 JP1.16
RC2
  Top 0.152: U$2.36 17.79,30.29 17,29.5 10.5,29.5 1.99,20.99 JP1.17
RC3  (via drill 0.35)
  Top 0.152: U$2.37 18.5,31.68 18.5,30 17.5,29 | 17.5,29 11,29 4,22 4,20 2.45,18.45 JP1.18 | U$3.6 26.73,27.77 v26,28.5 | v17.5,29.11 17.5,29 | v3.5,11.5 3.9,11.1 R7.2 5,11.05 | U$1.6 13.75,18.16 13.75,17 14.91,15.84 14.91,14.34 12.22,11.65 8.35,11.65 7.75,12.25 5.25,12.25 5,12 5,11.05 | 5,10.5 5,11.05 | R5.1 4.85,9 v3.5,9
  Bottom 0.152: v26,28.5 18.11,28.5 v17.5,29.11 | JP1.18 5.05,18.45 6,17.5 6,14 v3.5,11.5 v3.5,9 3.6,8.9 SJ4.1
RC4  (via drill 0.35)
  Top 0.152: U$2.42 22.56,30.94 23.5,30 25.75,30 | JP2.18 37.05,18.45 33.5,22 33.5,26 29.5,30 28,30 | 25.75,30 28,30 | 28,30 U$3.5 | v35,16.5 35,11.15 R6.2 35.05,9 | U$1.5 9.5,21.14 v9.5,23.5 | v23.61,29.25 25.25,29.25 25.75,29.75 25.75,30 | 35.05,9 R1.1 | v36.5,9 35.05,9
  Bottom 0.152: v35,16.5 36.3,16.5 JP2.18 | v9.5,23.5 16,30 22.86,30 v23.61,29.25 | SJ6.1 36.4,8.9 v36.5,9
RC5
  Top 0.152: U$2.43 23.38,31.12 24,30.5 30,30.5 34,26.5 34,23 36.01,20.99 JP2.17
RC6  (via drill 0.35)
  Top 0.152: U$2.44 25.5,31.76 | 25.5,31.76 33.74,31.76 35,30.5 35,27 34.5,26.5 34.5,24.61 35.46,23.65 SJ3.1 | v27,32.5 26,32.5 25.5,32 25.5,31.76
  Bottom 0.152: JP2.16 38.12,23.4 SJ3.1 | SJ5.1 11.21,8.15 17.4,8.15 22.25,13 22.25,15.14 19.73,17.66 19.73,18.23 26.94,25.44 26.94,32.44 v27,32.5
  other vias: 35.46,23.4
RC7  (via drill 0.35)
  Top 0.152: U$2.1 28.49,33.51 29,33 33.5,33 35.5,31 35.5,26.4 v35.46,26.4
  Bottom 0.152: v35.46,26.4 35.5,26.4 | 35.5,25.9 38.08,25.9 JP2.15 | SJ7.1 29.64,25.14 32.25,27.75 34.75,27.75 35.5,27 35.5,26.4 | 35.5,26.4 35.5,25.9 | SJ2.1 35.5,25.9
RD0
  Top 0.152: U$2.38 19.39,29.89 18,28.5 11.5,28.5 4.5,21.5 4.5,17 3.41,15.91 JP1.19
RD1
  Top 0.152: U$2.39 20.18,29.68 18.5,28 12,28 5,21 5,14.5 3.87,13.37 JP1.20
RD2
  Top 0.152: U$2.40 20.8,31.6 20.8,30.76 22.5,29.07 22.5,24 23,23.5 30,23.5 36,17.5 36,14.5 37.5,13 37.88,13 JP2.20
RD3
  Top 0.152: U$2.41 21.77,30.73 23,29.5 23,24.5 23.5,24 30.5,24 36.5,18 36.5,17 37.59,15.91 JP2.19
RD4
  Top 0.152: U$2.2 28.7,34.3 29.5,33.5 34,33.5 36,31.5 36,29.5 36.89,28.61 JP2.14
RD5
  Top 0.152: U$2.3 28.89,35.11 29.5,34.5 35,34.5 38.25,31.25 JP2.13
RD6
  Top 0.152: U$2.4 29.1,35.9 29.5,35.5 36.44,35.5 JP2.12
RD7
  Top 0.152: U$2.5 29.29,36.71 30,36 38.02,36 JP2.11
RE0  (via drill 0.35)
  Top 0.152: U$2.25 14.32,40 12.5,40 9.75,42.75 | 9.75,42.75 8.65,43.85 JP1.8 | U$3.1 24.2,17.24 24.01,17.06 18.94,17.06 17.75,18.25 v17.75,18.75 | v16.25,23.75 16.2,23.8 U$1.1 16.49,25.76 v17,25.25 | v8.5,42.5 9.5,42.5 9.75,42.75
  Bottom 0.152: v16.25,23.75 17.75,22.25 v17.75,18.75 | v17,25.25 16,24.25 12.79,24.25 11.04,22.5 9.12,22.5 8.45,23.18 8.45,33.2 10.2,34.95 10.2,37.8 8.5,39.5 v8.5,42.5
RE1  (via drill 0.35)
  Top 0.152: U$2.26 12.4,39.1 10.19,41.31 9.5,41.31 | 9.5,41.31 JP1.9 | U$3.2 25.46,19.31 25.27,19.5 17.25,19.5 14.94,21.82 U$1.2 15,25.82 v15,26.89 | v9.5,39.75 9.5,41.31
  Bottom 0.152: v15,26.89 10.91,22.8 9.25,22.8 8.75,23.3 8.75,33 10.5,34.75 10.5,38.75 v9.5,39.75
RE2
  Top 0.152: U$2.27 2.23,38.29 JP1.10
RX_LED  (via drill 0.35)
  Top 0.152: IC2.21 26.25,53.77 v26.23,53.75 | v28.7,28.8 28.7,27.3 28.64,27.25 28.64,25.42 v28.82,25.25 | v21.35,18.5 LED2.C
  Bottom 0.152: v26.23,53.75 28,51.98 28,49.64 29.64,48 29.64,29.75 v28.7,28.8 | v28.82,25.25 28.32,24.75 27.25,24.75 21.35,18.85 v21.35,18.5
RXD  (via drill 0.35)
  Top 0.152: v32.5,24 31.5,24 29.25,26.25 v29.25,27 | IC2.2 v27.25,60.25
  Bottom 0.152: SJ3.2 33.34,24 v32.5,24 | v27.25,60.25 27.75,60.25 28.25,59.75 28.25,59.25 28.5,59 29.25,59 30,58.25 30,53 28.91,51.91 28.91,50.75 28.91,50.02 30.55,48.38 30.55,29.95 31,29.5 31,27.5 29.5,26 29,26 28.75,26.25 28.75,26.5 v29.25,27
RXLED
  Top 0.152: LED2.A R9.1
TX_LED  (via drill 0.35)
  Top 0.152: IC2.22 26.87,54.48 26.87,54.23 27.14,53.96 v27.14,53.75 | v20.34,17.91 19.84,17.91 LED1.C
  Bottom 0.152: v27.14,53.75 27.14,53.27 28.3,52.11 28.3,50.75 28.3,49.76 29.95,48.12 29.95,29.2 27.3,26.55 27.3,25.31 20.34,18.34 v20.34,17.91
TXD  (via drill 0.35)
  Top 0.152: v29.13,56.5 29.13,57.07 28.55,57.65 IC2.30 | v31.5,25.25 30.25,26.5 v30.25,28
  Bottom 0.152: v29.13,56.5 29.13,52.63 28.61,52.11 28.61,49.89 30.25,48.25 v30.25,28 | SJ2.2 32.15,25.9 v31.5,25.25
USB_CATHODE
  Top 0.152: R3.2 USB.C
USB_D+  (via drill 0.35)
  Top 0.152: X2.3 20,66.08 v20,64.5 | v22.14,57.14 23.14,56.15 IC2.14
  Bottom 0.152: v20,64.5 21,64.5 22,63.5 22,57.28 v22.14,57.14
USB_D-  (via drill 0.35)
  Top 0.152: X2.2 20.98,63.02 v21,63 | v21.5,56.5 22.35,55.65 IC2.15
  Bottom 0.152: v21,63 21,57 v21.5,56.5
USB_VCC  (via drill 0.35)
  Top 0.152: C2.1 14.03,60.15 IC1.3 15.88,62 22.5,62 22.88,62.38 | X2.1 23.02,65 24,65 | USB.A 30,67 28,65 24,65 | 24,65 24,63.5 22.88,62.38 | 22.88,62.38 22.88,63.38 v23,63.5
  Bottom 0.152: v23,63.5 23,54.75 25.85,51.9 FUSE.1
  other vias: 27.05,51.9
VDD  (via drill 0.35)
  Top 0.152: 10,36 11,36 12.5,37.5 U$2.28 20,37.5 v20.5,38 20.79,38.29 U$2.7 27.79,38.29 30.81,41.31 JP2.9 | 10,36 1.98,36 JP1.11 | C1.1 v16,53.45 16.32,53.45 IC1.4 IC1.2 | ON.A 10.75,68.25 v16,63 | R4.2 16.7,47.3 v16,48 | v21.89,27.5 22,27.5 21.2,26.7 R9.2 R8.2 19,24.05 19,26.5 18,27.5 14.5,27.5 13.66,26.66 U$1.3 13.66,23.16 v13,22.5 16.2,19.3 U$1.8 16.2,16.8 16.5,16.5 26.5,16.5 26.73,16.73 26.73,17 | v24,27.5 24.2,27.3 U$3.8 | R1.2 33.15,5.88 JP4.1 28.36,1.09 16.75,1.09 | U$3.3 26.73,17 | v29,59.64 28.19,59.64 IC2.1 | v30.75,57.75 30.75,52.25 28.25,49.75 v26.75,49.75 | R5.2 6.85,7.65 7.5,7 11.25,7 12.25,6 12.25,4.98 JP3.1 11.64,1.09 16.75,1.09 | 16.75,1.09 17.46,1.8 JP5.2 | 26.73,17 v27.4,17 | 10,36 v9.25,35.25
  Bottom 0.152: SJ1.2 38.4,70.1 H8.B3,3 | v16,63 16.38,62.62 IC1.2 | 16,51.75 v16,48 16,42.5 v20.5,38 | 16,51.75 v16,53.45 | v21.89,27.5 v24,27.5 | 30.75,59.64 v29,59.64 | SJ1.2 38.22,66.16 | 16,51.75 22.89,51.75 24.89,49.75 v26.75,49.75 | v30.75,57.75 30.75,59.64 | JP5.2 17.46,7.78 26.68,17 v27.4,17 | v9.25,35.25 7.61,33.61 7.61,22.5 8.36,21.75 12.25,21.75 v13,22.5 | SJ1.2 35.41,66.16 30.75,61.5 30.75,59.64
  other vias: 16.38,60.2
(copper drawn outside any net)
  shapes: Top area x2

### Text on the board
tNames: MCLR | RB7/PGD | RA0/AN0 | RB6/PGC | RA1/AN1 | RB5/PGM | RA2/AN2 | RB4/AN11 | RA3/AN3 | RB3/AN9 | RA4/T0CKI | RB2/INT2 | RA5/AN4/~SS | RB1/INT1 | RE0/AN5/~RD | RB0/INT0 | RE1/AN6/~WR | VDD | RE2/AN7/~CS | GND | VDD | RD7/PSP7 | GND | RD6/PSP6 | RA7/CLKIN | RD5/PSP5 | RA6/CLKOUT | RD4/PSP4 | RC0/T13CLKI | RC7/RX | RC1/CCP2 | RC6/TX | RC2/CCP1 | RC5/SDO | RC3/SCK/SCL | RC4/SDA | RD0/PSP0 | RD3/PSP3 | RD1/PSP1 | RD2/PSP2 | + | - | MCLR | VDD | VSS | PGD | PGC | - | - | * | + | +
bNames: PIC18 Protoboard / EE 310 / Created By David Story / Meadowview Labs